# Altium schematic sheet SEPIC-MT3608_2025-10-18.schdoc
size 276 x 170 mm
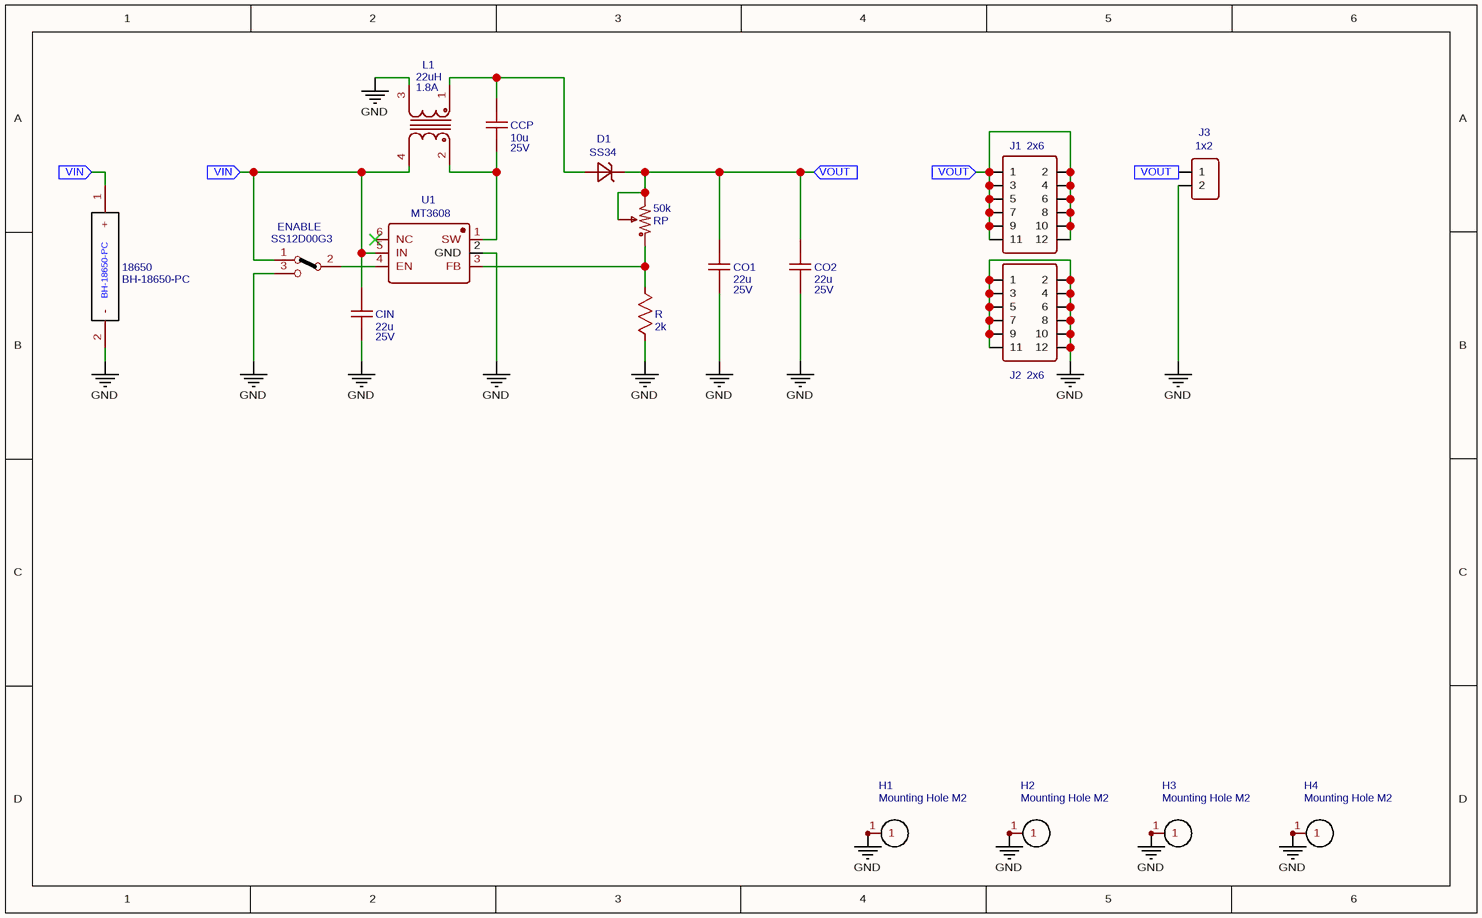
[diagram p0: SEPIC-MT3608_2025-10-18.schdoc]

## Parts
18650  BH-18650-PC  [BH-18650-PC-NO-SILK]
CCP  10u  [C_1210_HANDSOLDERING]
CIN  22u  [C_1210_HANDSOLDERING]
CO1  22u  [C_1210_HANDSOLDERING]
CO2  22u  [C_1210_HANDSOLDERING]
D1  SS34  [D_SMA]
ENABLE  SS12D00G3  [SLIDE_MINI_SWITCH]
H1  Mounting Hole M2  [MOUNTINGHOLE_2.2MM_M2_ISO14580_PAD]
H2  Mounting Hole M2  [MOUNTINGHOLE_2.2MM_M2_ISO14580_PAD]
H3  Mounting Hole M2  [MOUNTINGHOLE_2.2MM_M2_ISO14580_PAD]
H4  Mounting Hole M2  [MOUNTINGHOLE_2.2MM_M2_ISO14580_PAD]
J1  2x6  [HDR-M-2.54_2X6]
J2  2x6  [HDR-M-2.54_2X6]
J3  1x2  [HDR-M-2.54_1X2]
L1  22uH  [FILTER-SMD_4P-L7.6-W7.6-TL]
R  2k  [R_0603_HANDSOLDERING]
RP  50k  [RES-ADJ-TH_3296W-1-203]
U1  MT3608  [SOT-23-6_HANDSOLDERING]

## Ports
VIN (in), VOUT (in)

## Nets
GND: 18650.2(-) CIN.2 CO1.2 CO2.2 ENABLE.3(NO) H1.1 H2.1 H3.1 H4.1 J2.1 J2.2 J2.3 J2.4 J2.5 J2.6 J2.7 J2.8 J2.9 J2.10 J2.11 J2.12 J3.2 L1.3 R.1 U1.2(GND)
VIN: 18650.1(+) CIN.1 ENABLE.1(C) L1.4 U1.5(IN) ; port VIN
VOUT: CO1.1 CO2.1 D1.1 J1.1 J1.2 J1.3 J1.4 J1.5 J1.6 J1.7 J1.8 J1.9 J1.10 J1.11 J1.12 J3.1 RP.2 RP.3 ; port VOUT
NetCCP_1: CCP.1 L1.2 U1.1(SW)
NetCCP_2: CCP.2 D1.2 L1.1
NetENABLE_2: ENABLE.2(NC) U1.4(EN)
NetR_2: R.2 RP.1 U1.3(FB)

Not connected (* = marked no-connect by the designer): U1 6(NC)*

## Notes on the sheet
- (near L1) 1.8A
- (near CCP) 25V
- (near CO1) 25V
- (near CO2) 25V
- (near CIN) 25V

## Library data of the parts
18650 = BH-18650-PC: Contributor: anton_8359; link: http://www.memoryprotectiondevices.com/datasheets/BK-18650-PC2-datasheet.pdf; spicePre: C; spiceSymbolName: BH-18650-PC
CCP = 10u: nameAlias: Value(F); Contributor: LCEDA_Lib; spicePre: C; spiceSymbolName: C_0805_US
CIN CO1 CO2 = 22u: Manufacturer: SAMSUNG; Manufacturer Part: CL32A226KAJNNNE; nameAlias: Capacitance; Supplier: LCSC; Supplier Part: C52306; JLCPCB Part Class: Extended Part; spicePre: C; spiceSymbolName: CL32A226KAJNNNE
D1 = SS34: Manufacturer: BLUE ROCKET(蓝箭); Manufacturer Part: SMBJ100A; Contributor: LCSC; Supplier: LCSC; Supplier Part: C2900739; spicePre: D; spiceSymbolName: SMBJ100A_C2900739
ENABLE = SS12D00G3: Manufacturer Part: Switch SPDT; Contributor: hofteboy; Mounted: No; spicePre: S; spiceSymbolName: SS12D00G3
H1-H4 = Mounting Hole M2: Contributor: mieliepit911; spicePre: U; spiceSymbolName: 2MMHOLE-Han-S01
J1 J2 = 2x6: Contributor: LCEDA_Lib; Supplier Part: C124388; Supplier: LCSC; spicePre: J; spiceSymbolName: HDR-M-2.54_2x6
J3 = 1x2: Contributor: LCEDA_Lib; Supplier Part: C124375; Supplier: LCSC; spicePre: J; spiceSymbolName: HDR-M-2.54_1x2
L1 = 22uH: Manufacturer: null; Manufacturer Part: DRQ74-220-R; Contributor: LCSC; Supplier: LCSC; Supplier Part: C2895718; JLCPCB Part Class: Extended Part; spicePre: U; spiceSymbolName: DRQ74-220-R
R = 2k: nameAlias: Value(Ω); Contributor: LCEDA_Lib; spicePre: R; spiceSymbolName: R_0603_US
RP = 50k: nameAlias: Value; Contributor: LCEDA_Lib; value(Ω): 10K; Supplier: LCSC; spicePre: R; spiceSymbolName: R_3386P_US
U1 = MT3608: Manufacturer: AEROSEMI; Supplier: LCSC; Manufacturer Part: MT3608; Supplier Part: C84817; JLCPCB Part Class: Extended Part; spicePre: U; spiceSymbolName: MT3608